# Altium schematic sheet fpga.SchDoc
size C
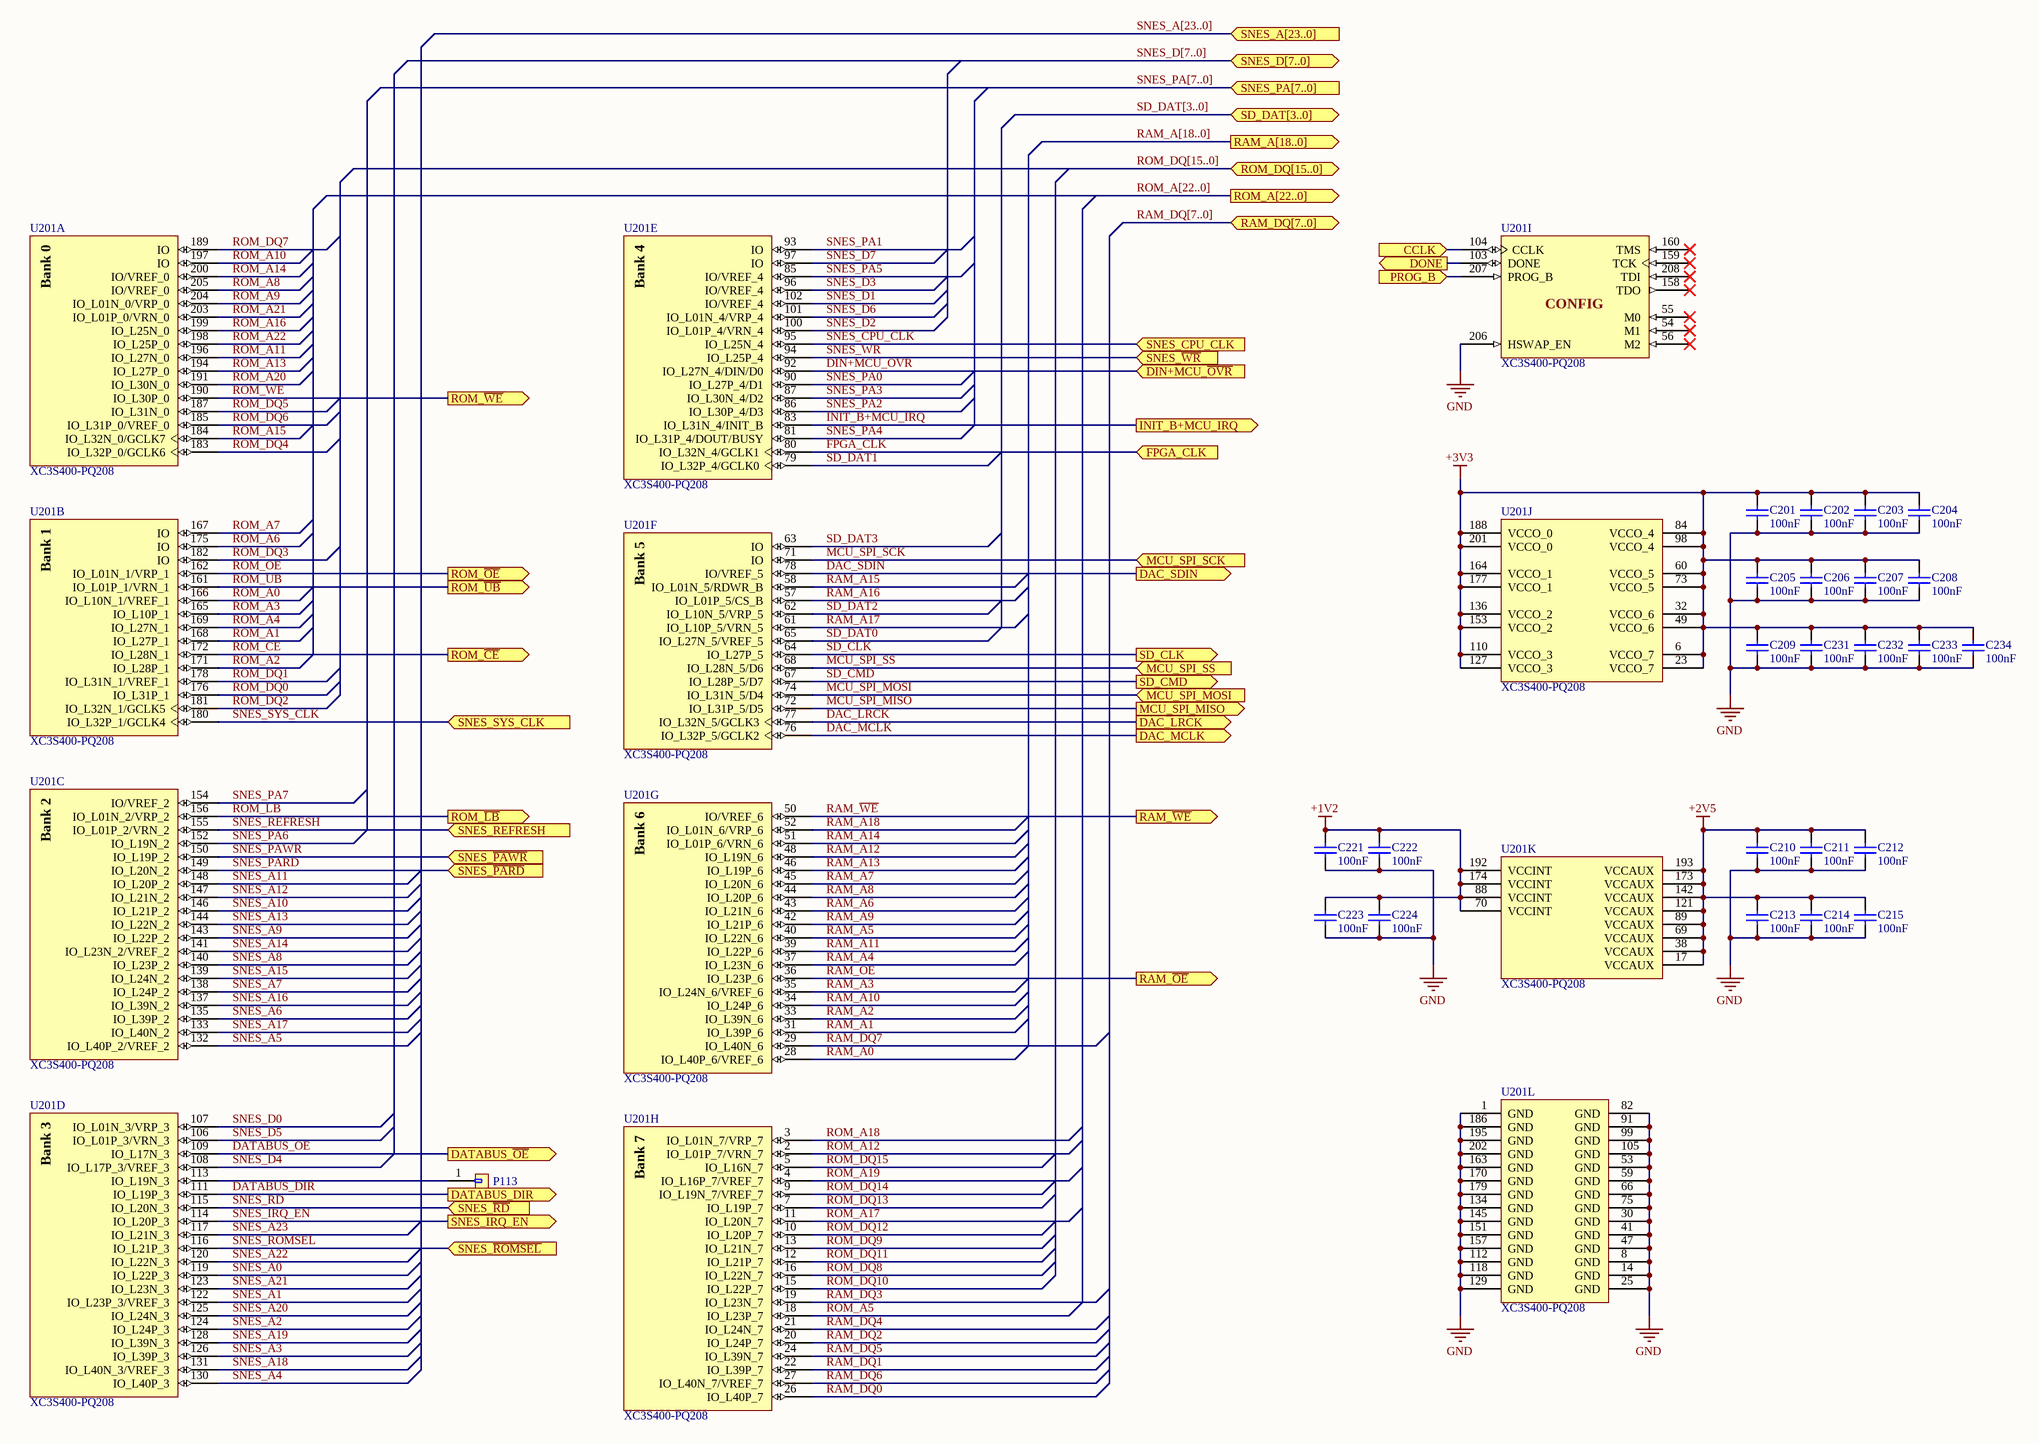
[diagram p0: fpga.SchDoc]

## Parts
C201  100nF  [SM0805]
C202  100nF  [SM0805]
C203  100nF  [SM0805]
C204  100nF  [SM0805]
C205  100nF  [SM0805]
C206  100nF  [SM0805]
C207  100nF  [SM0805]
C208  100nF  [SM0805]
C209  100nF  [SM0805]
C210  100nF  [SM0805]
C211  100nF  [SM0805]
C212  100nF  [SM0805]
C213  100nF  [SM0805]
C214  100nF  [SM0805]
C215  100nF  [SM0805]
C221  100nF  [SM0805]
C222  100nF  [SM0805]
C223  100nF  [SM0805]
C224  100nF  [SM0805]
C231  100nF  [SM0805]
C232  100nF  [SM0805]
C233  100nF  [SM0805]
C234  100nF  [SM0805]
P113  CONN_1  [CONN_1]  (value not drawn)
U201  XC3S400-PQ208  [PQFP208]  (parts A,B,C,D,E,F,G,H,I,J,K,L of 12)

## Ports
CCLK (in), DAC_LRCK (out), DAC_MCLK (out), DAC_SDIN (out), DATABUS_DIR (out), DATABUS_~{OE} (out), DIN+MCU_~{OVR} (in), DONE (out), FPGA_CLK (in), INIT_B+MCU_IRQ (out), MCU_SPI_MISO (out), MCU_SPI_MOSI (in), MCU_SPI_SCK (in), MCU_SPI_SS (in), PROG_B (in), RAM_A[18..0] (out), RAM_DQ[7..0] (bidir), RAM_~{OE} (out), RAM_~{WE} (out), ROM_A[22..0] (out), ROM_DQ[15..0] (bidir), ROM_~{CE} (out), ROM_~{LB} (out), ROM_~{OE} (out), ROM_~{UB} (out), ROM_~{WE} (out), SD_CLK (out), SD_CMD (out), SD_DAT[3..0] (bidir), SNES_A[23..0] (in), SNES_CPU_CLK (in), SNES_D[7..0] (bidir), SNES_IRQ_EN (out), SNES_PA[7..0] (in), SNES_REFRESH (in), SNES_SYS_CLK (in), SNES_~{PARD} (in), SNES_~{PAWR} (in), SNES_~{RD} (in), SNES_~{ROMSEL} (in), SNES_~{WR} (in)

## Nets
+1V2: C221.1 C222.1 C223.1 C224.1 U201.70(VCCINT) U201.88(VCCINT) U201.174(VCCINT) U201.192(VCCINT)
+2V5: C210.1 C211.1 C212.1 C213.1 C214.1 C215.1 U201.17(VCCAUX) U201.38(VCCAUX) U201.69(VCCAUX) U201.89(VCCAUX) U201.121(VCCAUX) U201.142(VCCAUX) U201.173(VCCAUX) U201.193(VCCAUX)
+3V3: C201.1 C202.1 C203.1 C204.1 C205.1 C206.1 C207.1 C208.1 C209.1 C231.1 C232.1 C233.1 C234.1 U201.6(VCCO_7) U201.23(VCCO_7) U201.32(VCCO_6) U201.49(VCCO_6) U201.60(VCCO_5) U201.73(VCCO_5) U201.84(VCCO_4) U201.98(VCCO_4) U201.110(VCCO_3) U201.127(VCCO_3) U201.136(VCCO_2) U201.153(VCCO_2) U201.164(VCCO_1) U201.177(VCCO_1) U201.188(VCCO_0) U201.201(VCCO_0)
GND: C201.2 C202.2 C203.2 C204.2 C205.2 C206.2 C207.2 C208.2 C209.2 C210.2 C211.2 C212.2 C213.2 C214.2 C215.2 C221.2 C222.2 C223.2 C224.2 C231.2 C232.2 C233.2 C234.2 U201.1(GND) U201.8(GND) U201.14(GND) U201.25(GND) U201.30(GND) U201.41(GND) U201.47(GND) U201.53(GND) U201.59(GND) U201.66(GND) U201.75(GND) U201.82(GND) U201.91(GND) U201.99(GND) U201.105(GND) U201.112(GND) U201.118(GND) U201.129(GND) U201.134(GND) U201.145(GND) U201.151(GND) U201.157(GND) U201.163(GND) U201.170(GND) U201.179(GND) U201.186(GND) U201.195(GND) U201.202(GND) U201.206(HSWAP_EN)
CCLK: U201.104(CCLK) ; port CCLK
DAC_LRCK: U201.77(IO_L32N_5/GCLK3) ; port DAC_LRCK
DAC_MCLK: U201.76(IO_L32P_5/GCLK2) ; port DAC_MCLK
DAC_SDIN: U201.78(IO/VREF_5) ; port DAC_SDIN
DATABUS_DIR: U201.111(IO_L19P_3) ; port DATABUS_DIR
DATABUS_~{OE}: U201.109(IO_L17N_3) ; port DATABUS_~{OE}
DIN+MCU_~{OVR}: U201.92(IO_L27N_4/DIN/D0) ; port DIN+MCU_~{OVR}
DONE: U201.103(DONE) ; port DONE
FPGA_CLK: U201.80(IO_L32N_4/GCLK1) ; port FPGA_CLK
INIT_B+MCU_IRQ: U201.83(IO_L31N_4/INIT_B) ; port INIT_B+MCU_IRQ
MCU_SPI_MISO: U201.72(IO_L31P_5/D5) ; port MCU_SPI_MISO
MCU_SPI_MOSI: U201.74(IO_L31N_5/D4) ; port MCU_SPI_MOSI
MCU_SPI_SCK: U201.71(IO) ; port MCU_SPI_SCK
MCU_SPI_SS: U201.68(IO_L28N_5/D6) ; port MCU_SPI_SS
PROG_B: U201.207(PROG_B) ; port PROG_B
RAM_A0: U201.28(IO_L40P_6/VREF_6)
RAM_A1: U201.31(IO_L39P_6)
RAM_A2: U201.33(IO_L39N_6)
RAM_A3: U201.35(IO_L24N_6/VREF_6)
RAM_A4: U201.37(IO_L23N_6)
RAM_A5: U201.40(IO_L22N_6)
RAM_A6: U201.43(IO_L21N_6)
RAM_A7: U201.45(IO_L20N_6)
RAM_A8: U201.44(IO_L20P_6)
RAM_A9: U201.42(IO_L21P_6)
RAM_A10: U201.34(IO_L24P_6)
RAM_A11: U201.39(IO_L22P_6)
RAM_A12: U201.48(IO_L19N_6)
RAM_A13: U201.46(IO_L19P_6)
RAM_A14: U201.51(IO_L01P_6/VRN_6)
RAM_A15: U201.58(IO_L01N_5/RDWR_B)
RAM_A16: U201.57(IO_L01P_5/CS_B)
RAM_A17: U201.61(IO_L10P_5/VRN_5)
RAM_A18: U201.52(IO_L01N_6/VRP_6)
RAM_DQ0: U201.26(IO_L40P_7)
RAM_DQ1: U201.22(IO_L39P_7)
RAM_DQ2: U201.20(IO_L24P_7)
RAM_DQ3: U201.19(IO_L23N_7)
RAM_DQ4: U201.21(IO_L24N_7)
RAM_DQ5: U201.24(IO_L39N_7)
RAM_DQ6: U201.27(IO_L40N_7/VREF_7)
RAM_DQ7: U201.29(IO_L40N_6)
RAM_~{OE}: U201.36(IO_L23P_6) ; port RAM_~{OE}
RAM_~{WE}: U201.50(IO/VREF_6) ; port RAM_~{WE}
ROM_A0: U201.166(IO_L10N_1/VREF_1)
ROM_A1: U201.168(IO_L27P_1)
ROM_A2: U201.171(IO_L28P_1)
ROM_A3: U201.165(IO_L10P_1)
ROM_A4: U201.169(IO_L27N_1)
ROM_A5: U201.18(IO_L23P_7)
ROM_A6: U201.175(IO)
ROM_A7: U201.167(IO)
ROM_A8: U201.205(IO/VREF_0)
ROM_A9: U201.204(IO_L01N_0/VRP_0)
ROM_A10: U201.197(IO)
ROM_A11: U201.196(IO_L27N_0)
ROM_A12: U201.2(IO_L01P_7/VRN_7)
ROM_A13: U201.194(IO_L27P_0)
ROM_A14: U201.200(IO/VREF_0)
ROM_A15: U201.184(IO_L32N_0/GCLK7)
ROM_A16: U201.199(IO_L25N_0)
ROM_A17: U201.11(IO_L20N_7)
ROM_A18: U201.3(IO_L01N_7/VRP_7)
ROM_A19: U201.4(IO_L16P_7/VREF_7)
ROM_A20: U201.191(IO_L30N_0)
ROM_A21: U201.203(IO_L01P_0/VRN_0)
ROM_A22: U201.198(IO_L25P_0)
ROM_~{CE}: U201.172(IO_L28N_1) ; port ROM_~{CE}
ROM_DQ0: U201.176(IO_L31P_1)
ROM_DQ1: U201.178(IO_L31N_1/VREF_1)
ROM_DQ2: U201.181(IO_L32N_1/GCLK5)
ROM_DQ3: U201.182(IO)
ROM_DQ4: U201.183(IO_L32P_0/GCLK6)
ROM_DQ5: U201.187(IO_L31N_0)
ROM_DQ6: U201.185(IO_L31P_0/VREF_0)
ROM_DQ7: U201.189(IO)
ROM_DQ8: U201.16(IO_L22N_7)
ROM_DQ9: U201.13(IO_L21N_7)
ROM_DQ10: U201.15(IO_L22P_7)
ROM_DQ11: U201.12(IO_L21P_7)
ROM_DQ12: U201.10(IO_L20P_7)
ROM_DQ13: U201.7(IO_L19P_7)
ROM_DQ14: U201.9(IO_L19N_7/VREF_7)
ROM_DQ15: U201.5(IO_L16N_7)
ROM_~{LB}: U201.156(IO_L01N_2/VRP_2) ; port ROM_~{LB}
ROM_~{OE}: U201.162(IO_L01N_1/VRP_1) ; port ROM_~{OE}
ROM_~{UB}: U201.161(IO_L01P_1/VRN_1) ; port ROM_~{UB}
ROM_~{WE}: U201.190(IO_L30P_0) ; port ROM_~{WE}
SD_CLK: U201.64(IO_L27P_5) ; port SD_CLK
SD_CMD: U201.67(IO_L28P_5/D7) ; port SD_CMD
SD_DAT0: U201.65(IO_L27N_5/VREF_5)
SD_DAT1: U201.79(IO_L32P_4/GCLK0)
SD_DAT2: U201.62(IO_L10N_5/VRP_5)
SD_DAT3: U201.63(IO)
SNES_A0: U201.119(IO_L22P_3)
SNES_A1: U201.122(IO_L23P_3/VREF_3)
SNES_A2: U201.124(IO_L24P_3)
SNES_A3: U201.126(IO_L39P_3)
SNES_A4: U201.130(IO_L40P_3)
SNES_A5: U201.132(IO_L40P_2/VREF_2)
SNES_A6: U201.135(IO_L39P_2)
SNES_A7: U201.138(IO_L24P_2)
SNES_A8: U201.140(IO_L23P_2)
SNES_A9: U201.143(IO_L22P_2)
SNES_A10: U201.146(IO_L21P_2)
SNES_A11: U201.148(IO_L20P_2)
SNES_A12: U201.147(IO_L21N_2)
SNES_A13: U201.144(IO_L22N_2)
SNES_A14: U201.141(IO_L23N_2/VREF_2)
SNES_A15: U201.139(IO_L24N_2)
SNES_A16: U201.137(IO_L39N_2)
SNES_A17: U201.133(IO_L40N_2)
SNES_A18: U201.131(IO_L40N_3/VREF_3)
SNES_A19: U201.128(IO_L39N_3)
SNES_A20: U201.125(IO_L24N_3)
SNES_A21: U201.123(IO_L23N_3)
SNES_A22: U201.120(IO_L22N_3)
SNES_A23: U201.117(IO_L21N_3)
SNES_CPU_CLK: U201.95(IO_L25N_4) ; port SNES_CPU_CLK
SNES_D0: U201.107(IO_L01N_3/VRP_3)
SNES_D1: U201.102(IO/VREF_4)
SNES_D2: U201.100(IO_L01P_4/VRN_4)
SNES_D3: U201.96(IO/VREF_4)
SNES_D4: U201.108(IO_L17P_3/VREF_3)
SNES_D5: U201.106(IO_L01P_3/VRN_3)
SNES_D6: U201.101(IO_L01N_4/VRP_4)
SNES_D7: U201.97(IO)
SNES_IRQ_EN: U201.114(IO_L20P_3) ; port SNES_IRQ_EN
SNES_~{PARD}: U201.149(IO_L20N_2) ; port SNES_~{PARD}
SNES_~{PAWR}: U201.150(IO_L19P_2) ; port SNES_~{PAWR}
SNES_PA0: U201.90(IO_L27P_4/D1)
SNES_PA1: U201.93(IO)
SNES_PA2: U201.86(IO_L30P_4/D3)
SNES_PA3: U201.87(IO_L30N_4/D2)
SNES_PA4: U201.81(IO_L31P_4/DOUT/BUSY)
SNES_PA5: U201.85(IO/VREF_4)
SNES_PA6: U201.152(IO_L19N_2)
SNES_PA7: U201.154(IO/VREF_2)
SNES_~{RD}: U201.115(IO_L20N_3) ; port SNES_~{RD}
SNES_~{ROMSEL}: U201.116(IO_L21P_3) ; port SNES_~{ROMSEL}
SNES_REFRESH: U201.155(IO_L01P_2/VRN_2) ; port SNES_REFRESH
SNES_SYS_CLK: U201.180(IO_L32P_1/GCLK4) ; port SNES_SYS_CLK
SNES_~{WR}: U201.94(IO_L25P_4) ; port SNES_~{WR}
NetP113_1: P113.1 U201.113(IO_L19N_3)

Not connected (* = marked no-connect by the designer): U201 54(M1)* 55(M0)* 56(M2)* 158(TDO)* 159(TCK)* 160(TMS)* 208(TDI)*

## Buses and harness runs
bus RAM_A[18..0] = port RAM_A[18..0]
bus RAM_DQ[7..0] = port RAM_DQ[7..0]
bus ROM_A[22..0] = port ROM_A[22..0]
bus ROM_DQ[15..0] = port ROM_DQ[15..0]
bus SD_DAT[3..0] = port SD_DAT[3..0]
bus SNES_A[23..0] = port SNES_A[23..0]
bus SNES_D[7..0] = port SNES_D[7..0]
bus SNES_PA[7..0] = port SNES_PA[7..0]

## Notes on the sheet
- (in symbol XC3S400-PQ208, part A) Bank 0
- (in symbol XC3S400-PQ208, part B) Bank 1
- (in symbol XC3S400-PQ208, part C) Bank 2
- (in symbol XC3S400-PQ208, part D) Bank 3
- (in symbol XC3S400-PQ208, part E) Bank 4
- (in symbol XC3S400-PQ208, part F) Bank 5
- (in symbol XC3S400-PQ208, part G) Bank 6
- (in symbol XC3S400-PQ208, part H) Bank 7
- (in symbol XC3S400-PQ208, part I) CONFIG

## Library data of the parts
C201-C215 C221-C224 C231-C234 = Cap: Capacitor; Value: 100nF